# EAGLE design try1 (EAGLE 8.1.0)
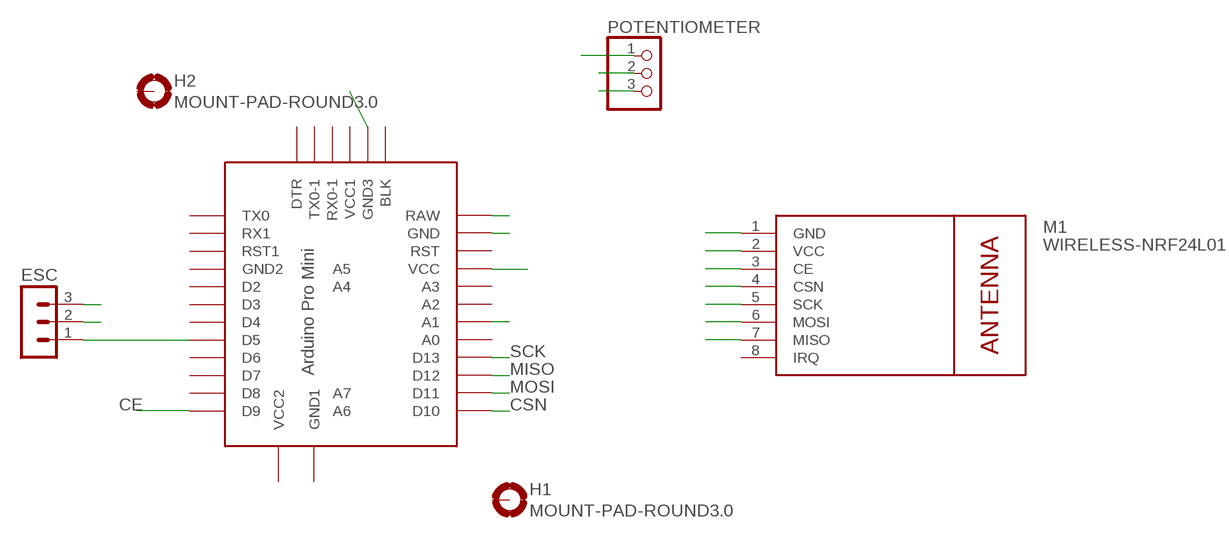
[diagram p0: schematic, sheet 1]

## Parts
ESC  MA03-1  [MA03-1]
H1  MOUNT-PAD-ROUND3.0  [3,0-PAD]
H2  MOUNT-PAD-ROUND3.0  [3,0-PAD]
M1  WIRELESS-NRF24L01  [WIRELESS-NRF24L01]
POTENTIOMETER  PINHD-1X3  [1X03]
U$2  PRO-MINI-33  [PRO-MINI-33]

## Nets
CE: M1.3(CE) U$2.D9
CSN: M1.4(CSN) U$2.D10
GND: ESC.3 M1.1(GND) POTENTIOMETER.3 U$2.GND U$2.GND3
MISO: M1.7(MISO) U$2.D12
MOSI: M1.6(MOSI) U$2.D11
RAW: ESC.2 U$2.RAW
SCK: M1.5(SCK) U$2.D13
SIG: ESC.1 POTENTIOMETER.1 U$2.A1 U$2.D5
VCC: M1.2(VCC) POTENTIOMETER.2 U$2.VCC
Unconnected: H1.B3,0(MOUNT) H2.B3,0(MOUNT) M1.8(IRQ) U$2.A0 U$2.A2 U$2.A3 U$2.A4 U$2.A5 U$2.A6 U$2.A7 U$2.BLK U$2.D2 U$2.D3 U$2.D4 U$2.D6 U$2.D7 U$2.D8 U$2.DTR U$2.GND1 U$2.GND2 U$2.RST U$2.RST1 U$2.RX0-1 U$2.RX1 U$2.TX0 U$2.TX0-1 U$2.VCC1 U$2.VCC2

## Library data of the parts
ESC = con-lstb:MA03-1: PIN HEADER; OC_FARNELL: unknown; OC_NEWARK: unknown
H1 H2 = holes:MOUNT-PAD-ROUND: MOUNTING PAD, round
M1 = diy-modules:WIRELESS-NRF24L01: 2.4 GHz Wireless Module based on NRF24L01 chip More details available here: http://www.electrodragon.com/w/NRF24L01
POTENTIOMETER = pinhead:PINHD-1X3: PIN HEADER
U$2 = Arduino-clone (copy):PRO-MINI-33: Arduino Pro Mini 3.3V Intellectual-Tech.com

## Net classes
0 default: width 0.508 mm, drill 0.762 mm, clearance 0.205 mm

## Board
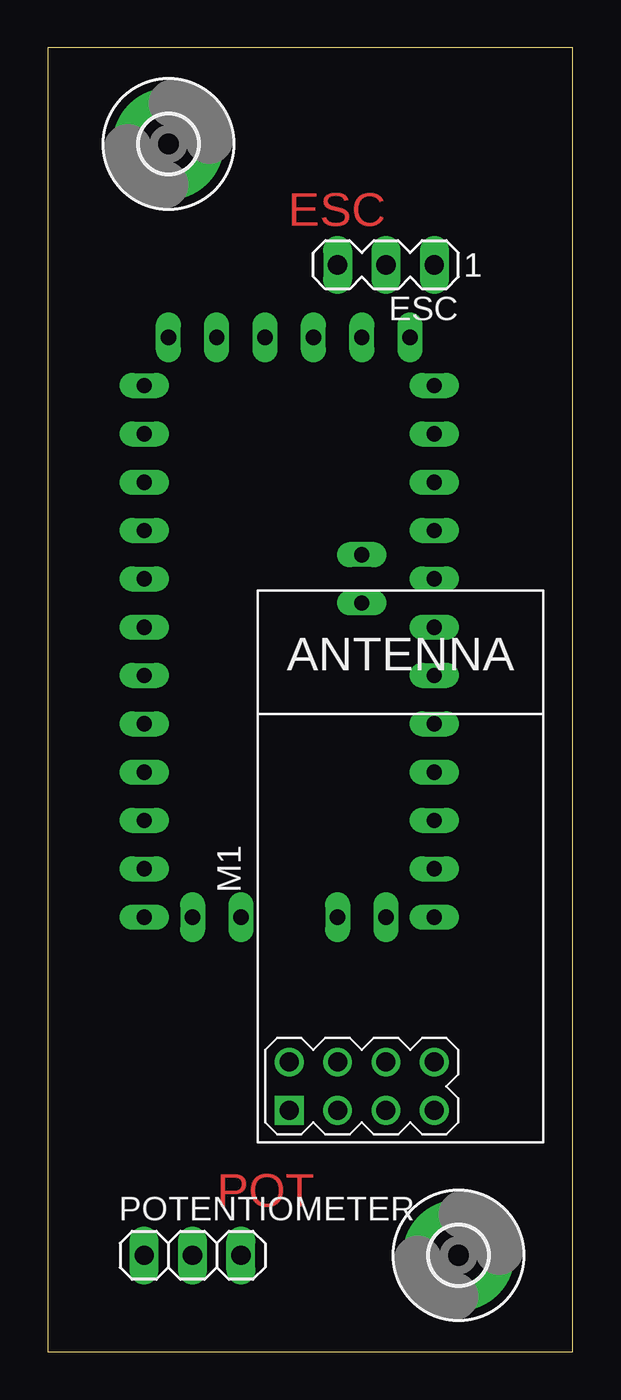
[diagram p1: board, top side]
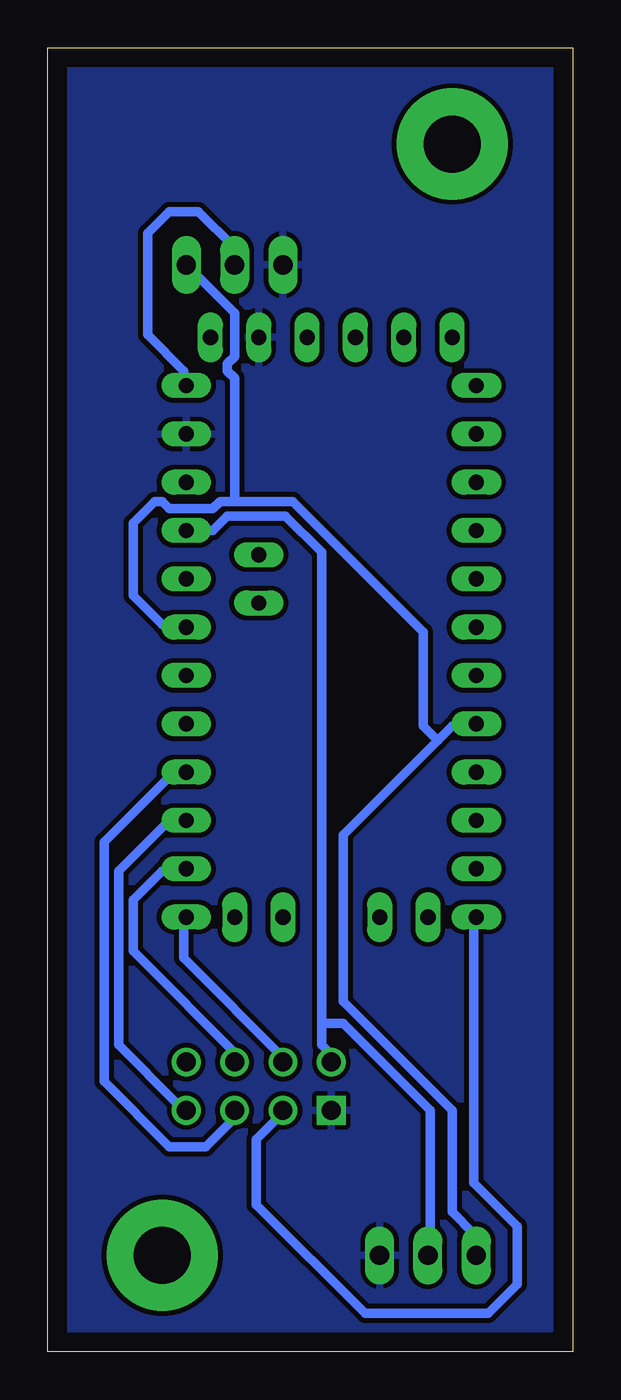
[diagram p2: board, bottom side, seen from below]

Size 27.61 x 68.57 mm. Coordinates in mm from the lower left corner, seen from the top.
Outline: 0,0 27.61,0 27.61,68.57 0,68.57 0,0
Copper layers (1*16): Top 0.035mm / dielectric 1.5mm / Bottom 0.035mm
Design rules "default *": minimum track width 12mil, minimum drill 24mil, track to track 10mil, track to pad 8mil, pad to pad 8mil, via to via 8mil, smd to smd 8mil, copper to edge 40mil, drill to drill 8mil, minimum pad ring 10mil, minimum via ring 8mil, stop-mask expansion 4mil, vias tented up to drill 0mil, thermal gap 10mil

### Footprints (pad centres in the part's own frame; a part is rotated, then mirrored left to right if it is on the bottom)
MA03-1 = drill 1.016 long: 1 -2.54,0; 2 0,0; 3 2.54,0
3,0-PAD = drill 3 pad 5.842: B3,0 0,0
WIRELESS-NRF24L01 = drill 1 square: 1 -12.7,6.35 | drill 1: 2 -10.16,6.35; 3 -12.7,3.81; 4 -10.16,3.81; 5 -12.7,1.27; 6 -10.16,1.27; 7 -12.7,-1.27; 8 -10.16,-1.27
1X03 = drill 1.016 long: 1 -2.54,0; 2 0,0; 3 2.54,0
PRO-MINI-33 = drill 0.8 long: A0 6.35,2.54; A1 6.35,0; A2 6.35,-2.54; A3 6.35,-5.08; A4 2.54,1.27; A5 2.54,3.81; A6 3.81,-15.24; A7 1.27,-15.24; BLK 5.08,15.24; D2 -8.89,2.54; D3 -8.89,0; D4 -8.89,-2.54; D5 -8.89,-5.08; D6 -8.89,-7.62; D7 -8.89,-10.16; D8 -8.89,-12.7; D9 -8.89,-15.24; D10 6.35,-15.24; D11 6.35,-12.7; D12 6.35,-10.16; D13 6.35,-7.62; DTR -7.62,15.24; GND 6.35,10.16; GND1 -3.81,-15.24; GND2 -8.89,5.08; GND3 2.54,15.24; RAW 6.35,12.7; RST 6.35,7.62; RST1 -8.89,7.62; RX0-1 -2.54,15.24; RX1 -8.89,10.16; TX0 -8.89,12.7; TX0-1 -5.08,15.24; VCC 6.35,5.08; VCC1 0,15.24; VCC2 -6.35,-15.24

### Placement (x,y rotation side)
ESC  17.78,57.15 180 top
H1  21.59,5.08 0 top
H2  6.35,63.5 0 top
M1  19.05,25.4 90 top
POTENTIOMETER  7.62,5.08 0 top
U$2  13.97,38.1 0 top

### Tracks (layer width: path | path; a pad name or v marks a point on that pad's centre or on a via)
CE
  Bottom 0.508: U$2.D9 5.21,22.61 5.21,8.89 2.92,6.6 2.92,3.56 4.45,2.03 10.92,2.03 16.64,7.75 16.64,11.18 15.11,12.7 M1.3
CSN
  Bottom 0.508: U$2.D10 20.45,22.61 20.45,20.7 15.11,15.37 M1.4
GND
  pour Bottom: 0,68.58 0,0 27.94,0 27.94,68.58
MISO
  Bottom 0.508: U$2.D12 21.21,27.94 23.88,25.27 23.88,16.13 20.83,13.08 20.45,13.08 20.07,12.7 M1.7
MOSI
  Bottom 0.508: U$2.D11 20.45,25.27 21.59,25.27 23.11,23.75 23.11,21.08 17.4,15.37 17.78,14.99 M1.6
RAW
  Bottom 0.508: ESC.2 17.78,58.04 19.68,59.94 21.21,59.94 22.35,58.8 22.35,53.47 20.45,51.56 20.45,50.8 U$2.RAW
SCK
  Bottom 0.508: M1.5 17.78,12.32 19.3,10.79 21.21,10.79 24.64,14.22 24.64,26.8 21.21,30.23 20.45,30.23 U$2.D13
SIG
  Bottom 0.508: 7.11,32.13 12.07,27.18 12.07,18.41 6.35,12.7 6.35,7.37 5.21,6.22 5.21,5.08 POTENTIOMETER.1 | 7.11,32.13 6.35,32.89 5.21,32.89 U$2.D5 | 17.78,44.7 14.73,44.7 7.87,37.85 7.87,32.89 7.11,32.13 | 17.78,44.7 18.54,44.7 18.92,44.32 21.21,44.32 21.59,44.7 21.97,44.7 23.11,43.56 23.11,39.75 21.59,38.23 20.45,38.23 U$2.A1 | ESC.1 17.78,54.61 17.78,52.32 18.16,51.94 18.16,51.56 17.78,51.18 17.78,44.7
VCC
  Bottom 0.508: U$2.VCC 18.92,43.18 18.16,43.94 15.11,43.94 13.21,42.04 13.21,17.27 | 13.21,17.27 13.21,16.13 12.45,15.37 M1.2 | 13.21,17.27 12.07,17.27 7.49,12.7 7.49,5.08 POTENTIOMETER.2

### Text on the board
Top: ESC | POT